# Altium schematic sheet Main.SchDoc
size A3; SheetNumber: 1; SheetTotal: 1
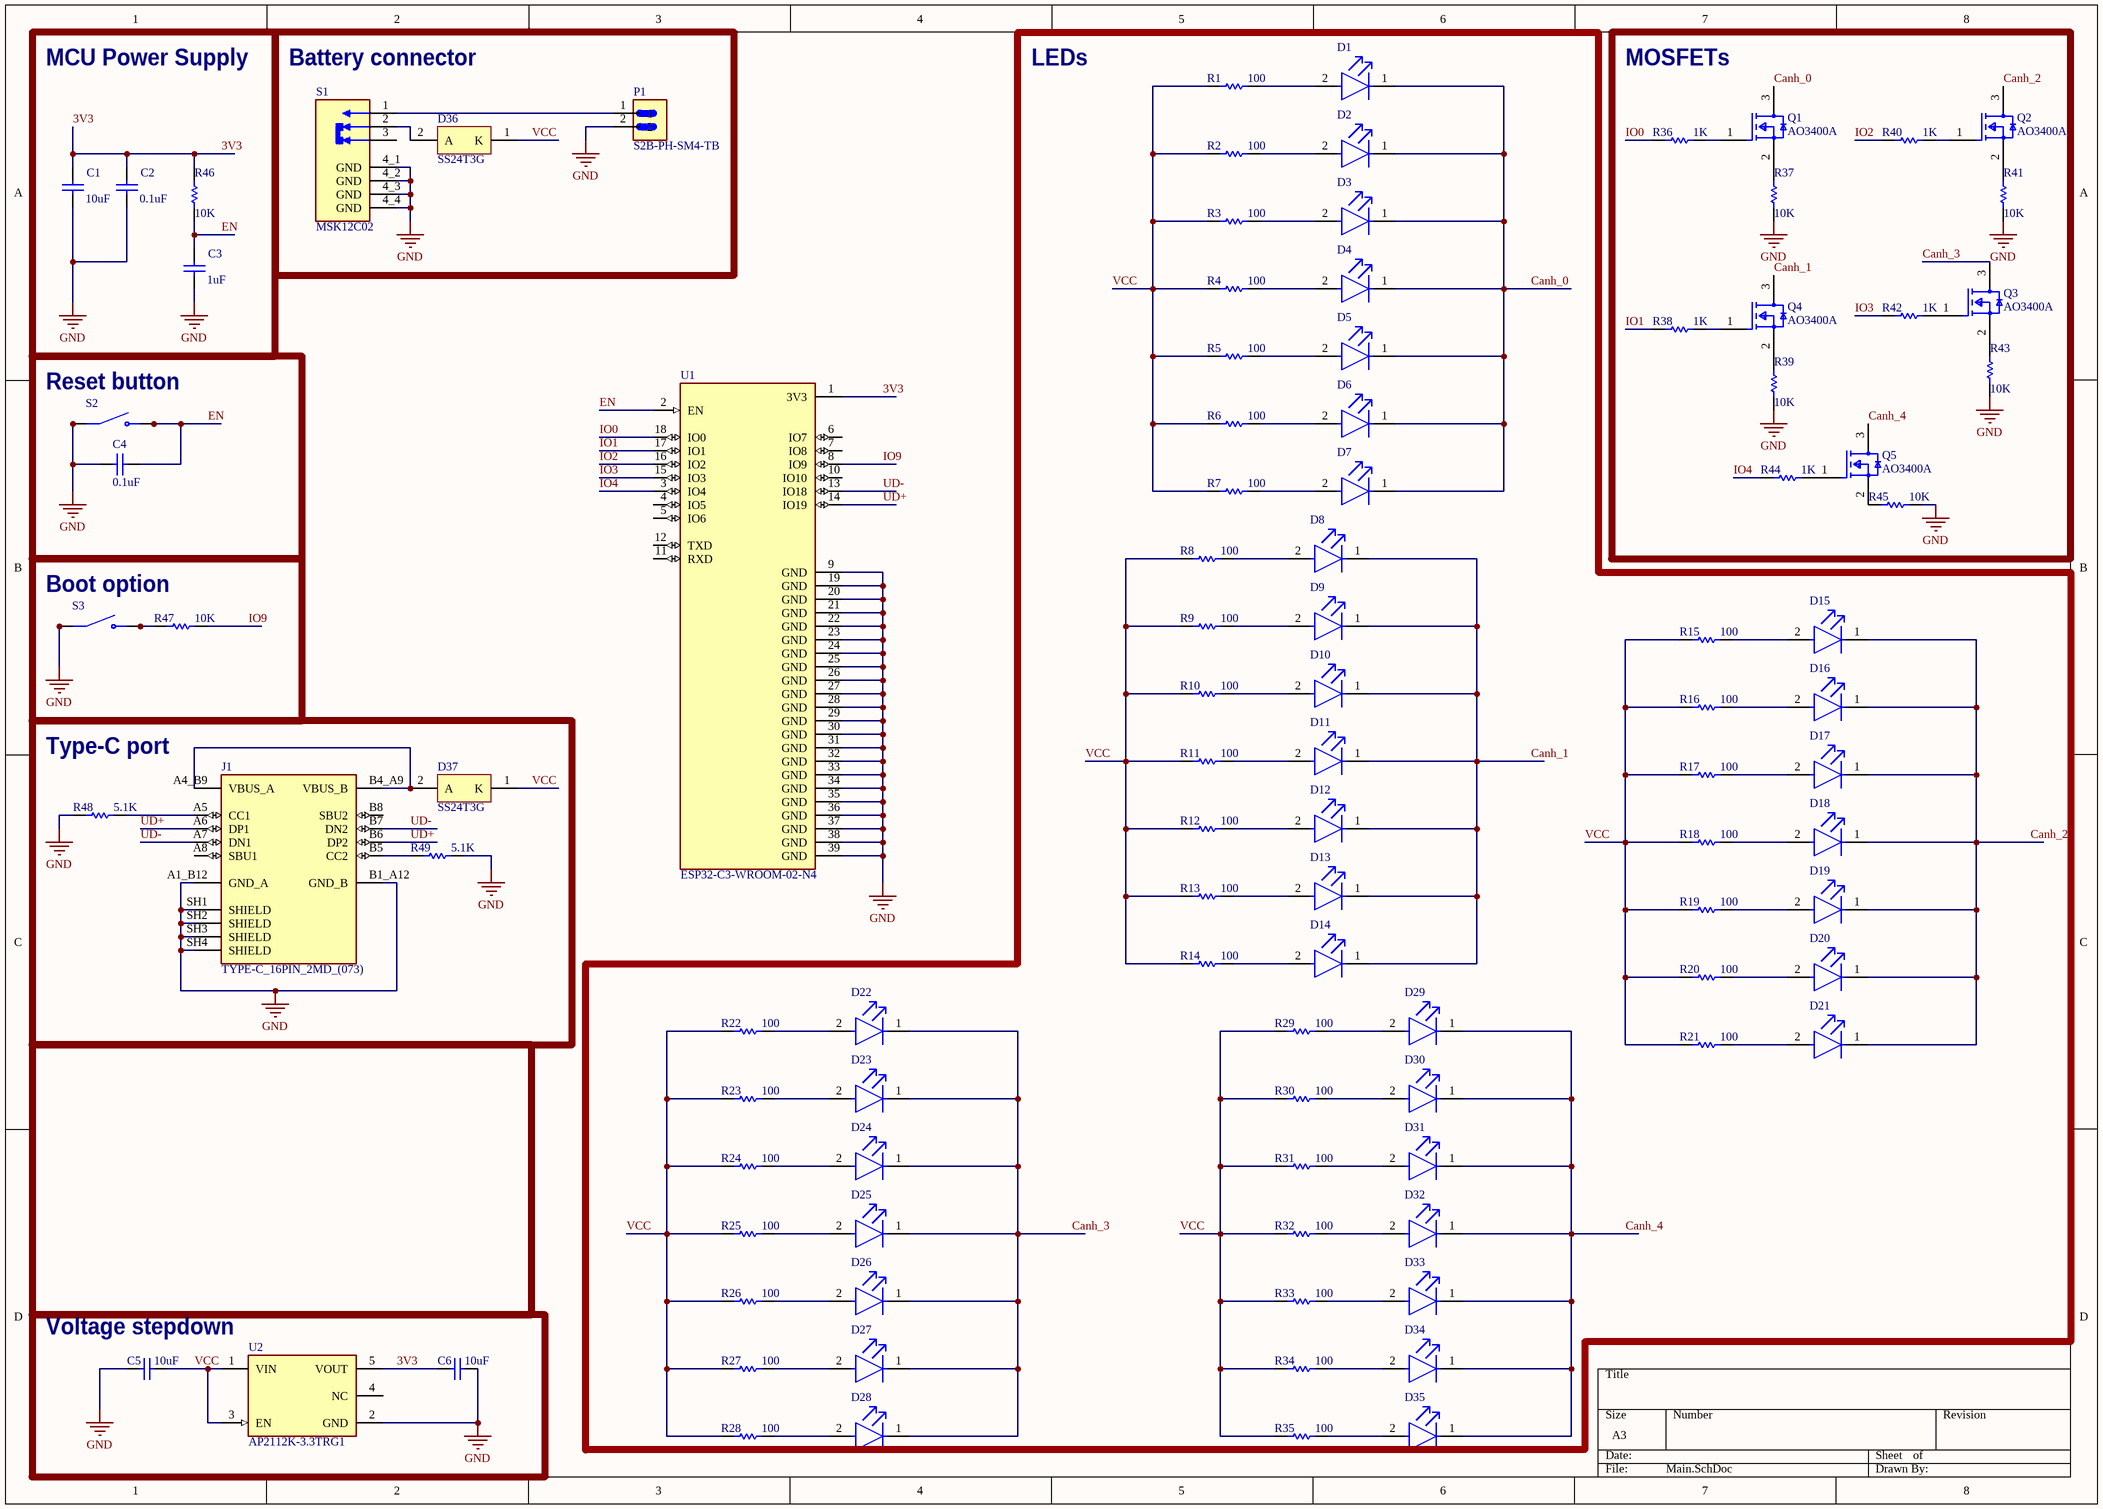
[diagram p0: Main.SchDoc]

## Parts
C1  value 10uF  [1608[0603]cap]  (hidden comment: Cap Semi)
C2  value 0.1uF  [1608[0603]cap]  (hidden comment: Cap Semi)
C3  value 1uF  [1608[0603]cap]  (hidden comment: Cap Semi)
C4  value 0.1uF  [1608[0603]cap]  (hidden comment: Cap Semi)
C5  value 10uF  [1608[0603]cap]  (hidden comment: Cap Semi)
C6  value 10uF  [1608[0603]cap]  (hidden comment: Cap Semi)
D1  SSL-LX5093YD  [FP-SSL-LX5093YD-MFG]  (value not drawn)
D2  SSL-LX5093YD  [FP-SSL-LX5093YD-MFG]  (value not drawn)
D3  SSL-LX5093YD  [FP-SSL-LX5093YD-MFG]  (value not drawn)
D4  SSL-LX5093YD  [FP-SSL-LX5093YD-MFG]  (value not drawn)
D5  SSL-LX5093YD  [FP-SSL-LX5093YD-MFG]  (value not drawn)
D6  SSL-LX5093YD  [FP-SSL-LX5093YD-MFG]  (value not drawn)
D7  SSL-LX5093YD  [FP-SSL-LX5093YD-MFG]  (value not drawn)
D8  SSL-LX5093YD  [FP-SSL-LX5093YD-MFG]  (value not drawn)
D9  SSL-LX5093YD  [FP-SSL-LX5093YD-MFG]  (value not drawn)
D10  SSL-LX5093YD  [FP-SSL-LX5093YD-MFG]  (value not drawn)
D11  SSL-LX5093YD  [FP-SSL-LX5093YD-MFG]  (value not drawn)
D12  SSL-LX5093YD  [FP-SSL-LX5093YD-MFG]  (value not drawn)
D13  SSL-LX5093YD  [FP-SSL-LX5093YD-MFG]  (value not drawn)
D14  SSL-LX5093YD  [FP-SSL-LX5093YD-MFG]  (value not drawn)
D15  SSL-LX5093YD  [FP-SSL-LX5093YD-MFG]  (value not drawn)
D16  SSL-LX5093YD  [FP-SSL-LX5093YD-MFG]  (value not drawn)
D17  SSL-LX5093YD  [FP-SSL-LX5093YD-MFG]  (value not drawn)
D18  SSL-LX5093YD  [FP-SSL-LX5093YD-MFG]  (value not drawn)
D19  SSL-LX5093YD  [FP-SSL-LX5093YD-MFG]  (value not drawn)
D20  SSL-LX5093YD  [FP-SSL-LX5093YD-MFG]  (value not drawn)
D21  SSL-LX5093YD  [FP-SSL-LX5093YD-MFG]  (value not drawn)
D22  SSL-LX5093YD  [FP-SSL-LX5093YD-MFG]  (value not drawn)
D23  SSL-LX5093YD  [FP-SSL-LX5093YD-MFG]  (value not drawn)
D24  SSL-LX5093YD  [FP-SSL-LX5093YD-MFG]  (value not drawn)
D25  SSL-LX5093YD  [FP-SSL-LX5093YD-MFG]  (value not drawn)
D26  SSL-LX5093YD  [FP-SSL-LX5093YD-MFG]  (value not drawn)
D27  SSL-LX5093YD  [FP-SSL-LX5093YD-MFG]  (value not drawn)
D28  SSL-LX5093YD  [FP-SSL-LX5093YD-MFG]  (value not drawn)
D29  SSL-LX5093YD  [FP-SSL-LX5093YD-MFG]  (value not drawn)
D30  SSL-LX5093YD  [FP-SSL-LX5093YD-MFG]  (value not drawn)
D31  SSL-LX5093YD  [FP-SSL-LX5093YD-MFG]  (value not drawn)
D32  SSL-LX5093YD  [FP-SSL-LX5093YD-MFG]  (value not drawn)
D33  SSL-LX5093YD  [FP-SSL-LX5093YD-MFG]  (value not drawn)
D34  SSL-LX5093YD  [FP-SSL-LX5093YD-MFG]  (value not drawn)
D35  SSL-LX5093YD  [FP-SSL-LX5093YD-MFG]  (value not drawn)
D36  SS24T3G  [ONSC-SMB-2-403A-03_V]
D37  SS24T3G  [ONSC-SMB-2-403A-03_V]
J1  TYPE-C_16PIN_2MD_(073)  [SHOUHAN_TYPE-C_16PIN_2MD_(073)]
P1  S2B-PH-SM4-TB  [JST_S2B-PH-SM4-TB]
Q1  AO3400A  [FP-SOT23-MFG]
Q2  AO3400A  [FP-SOT23-MFG]
Q3  AO3400A  [FP-SOT23-MFG]
Q4  AO3400A  [FP-SOT23-MFG]
Q5  AO3400A  [FP-SOT23-MFG]
R1  100  [MY_0603]
R2  100  [MY_0603]
R3  100  [MY_0603]
R4  100  [MY_0603]
R5  100  [MY_0603]
R6  100  [MY_0603]
R7  100  [MY_0603]
R8  100  [MY_0603]
R9  100  [MY_0603]
R10  100  [MY_0603]
R11  100  [MY_0603]
R12  100  [MY_0603]
R13  100  [MY_0603]
R14  100  [MY_0603]
R15  100  [MY_0603]
R16  100  [MY_0603]
R17  100  [MY_0603]
R18  100  [MY_0603]
R19  100  [MY_0603]
R20  100  [MY_0603]
R21  100  [MY_0603]
R22  100  [MY_0603]
R23  100  [MY_0603]
R24  100  [MY_0603]
R25  100  [MY_0603]
R26  100  [MY_0603]
R27  100  [MY_0603]
R28  100  [MY_0603]
R29  100  [MY_0603]
R30  100  [MY_0603]
R31  100  [MY_0603]
R32  100  [MY_0603]
R33  100  [MY_0603]
R34  100  [MY_0603]
R35  100  [MY_0603]
R36  1K  [MY_0603]
R37  10K  [MY_0603]
R38  1K  [MY_0603]
R39  10K  [MY_0603]
R40  1K  [MY_0603]
R41  10K  [MY_0603]
R42  1K  [MY_0603]
R43  10K  [MY_0603]
R44  1K  [MY_0603]
R45  10K  [MY_0603]
R46  10K  [MY_0603]
R47  10K  [MY_0603]
R48  5.1K  [MY_0603]
R49  5.1K  [MY_0603]
S1  MSK12C02  [SW_MSK12C02]
S2  1571527-2  [SW_1571527-2]  (value not drawn)
S3  1571527-2  [SW_1571527-2]  (value not drawn)
U1  ESP32-C3-WROOM-02-N4  [MODULE_ESP32-C3-WROOM-02-H4]
U2  AP2112K-3.3TRG1  [FP-SOT25-IPC_A]

## Blocks framed on the sheet
MCU Power Supply: C1-C3 R46
Battery connector: D36 P1 S1
LEDs: D1-D35 R1-R35
MOSFETs: Q1-Q5 R36-R45
Reset button: C4 S2
Boot option: R47 S3
Type-C port: D37 J1 R48 R49
Voltage stepdown: C5 C6 U2

## Nets
GND: C1.1 C2.1 C3.1 C4.2 C5.2 C6.1 J1.A1_B12(GND_A) J1.B1_A12(GND_B) J1.SH1(SHIELD) J1.SH2(SHIELD) J1.SH3(SHIELD) J1.SH4(SHIELD) P1.2 R37.1 R39.1 R41.1 R43.1 R45.1 R48.2 R49.1 S1.4_1(GND) S1.4_2(GND) S1.4_3(GND) S1.4_4(GND) S2.1(COM) S2.2(COM) S3.1(COM) S3.2(COM) U1.9(GND) U1.19(GND) U1.20(GND) U1.21(GND) U1.22(GND) U1.23(GND) U1.24(GND) U1.25(GND) U1.26(GND) U1.27(GND) U1.28(GND) U1.29(GND) U1.30(GND) U1.31(GND) U1.32(GND) U1.33(GND) U1.34(GND) U1.35(GND) U1.36(GND) U1.37(GND) U1.38(GND) U1.39(GND) U2.2(GND)
3V3: C1.2 C2.2 C6.2 R46.2 U1.1(3V3) U2.5(VOUT)
Canh_0: D1.1(C) D2.1(C) D3.1(C) D4.1(C) D5.1(C) D6.1(C) D7.1(C) Q1.3(D)
Canh_1: D8.1(C) D9.1(C) D10.1(C) D11.1(C) D12.1(C) D13.1(C) D14.1(C) Q4.3(D)
Canh_2: D15.1(C) D16.1(C) D17.1(C) D18.1(C) D19.1(C) D20.1(C) D21.1(C) Q2.3(D)
Canh_3: D22.1(C) D23.1(C) D24.1(C) D25.1(C) D26.1(C) D27.1(C) D28.1(C) Q3.3(D)
Canh_4: D29.1(C) D30.1(C) D31.1(C) D32.1(C) D33.1(C) D34.1(C) D35.1(C) Q5.3(D)
EN: C3.2 C4.1 R46.1 S2.3(NO) S2.4(NO) U1.2(EN)
IO0: R36.1 U1.18(IO0)
IO1: R38.1 U1.17(IO1)
IO2: R40.1 U1.16(IO2)
IO3: R42.1 U1.15(IO3)
IO4: R44.1 U1.3(IO4)
IO9: R47.1 U1.8(IO9)
UD+: J1.A6(DP1) J1.B6(DP2) U1.14(IO19)
UD-: J1.A7(DN1) J1.B7(DN2) U1.13(IO18)
VCC: C5.1 D36.1(K) D37.1(K) R1.1 R2.1 R3.1 R4.1 R5.1 R6.1 R7.1 R8.1 R9.1 R10.1 R11.1 R12.1 R13.1 R14.1 R15.1 R16.1 R17.1 R18.1 R19.1 R20.1 R21.1 R22.1 R23.1 R24.1 R25.1 R26.1 R27.1 R28.1 R29.1 R30.1 R31.1 R32.1 R33.1 R34.1 R35.1 U2.1(VIN) U2.3(EN)
NetD1_2: D1.2(A) R1.2
NetD2_2: D2.2(A) R2.2
NetD3_2: D3.2(A) R3.2
NetD4_2: D4.2(A) R4.2
NetD5_2: D5.2(A) R5.2
NetD6_2: D6.2(A) R6.2
NetD7_2: D7.2(A) R7.2
NetD8_2: D8.2(A) R8.2
NetD9_2: D9.2(A) R9.2
NetD10_2: D10.2(A) R10.2
NetD11_2: D11.2(A) R11.2
NetD12_2: D12.2(A) R12.2
NetD13_2: D13.2(A) R13.2
NetD14_2: D14.2(A) R14.2
NetD15_2: D15.2(A) R15.2
NetD16_2: D16.2(A) R16.2
NetD17_2: D17.2(A) R17.2
NetD18_2: D18.2(A) R18.2
NetD19_2: D19.2(A) R19.2
NetD20_2: D20.2(A) R20.2
NetD21_2: D21.2(A) R21.2
NetD22_2: D22.2(A) R22.2
NetD23_2: D23.2(A) R23.2
NetD24_2: D24.2(A) R24.2
NetD25_2: D25.2(A) R25.2
NetD26_2: D26.2(A) R26.2
NetD27_2: D27.2(A) R27.2
NetD28_2: D28.2(A) R28.2
NetD29_2: D29.2(A) R29.2
NetD30_2: D30.2(A) R30.2
NetD31_2: D31.2(A) R31.2
NetD32_2: D32.2(A) R32.2
NetD33_2: D33.2(A) R33.2
NetD34_2: D34.2(A) R34.2
NetD35_2: D35.2(A) R35.2
NetD36_2: D36.2(A) S1.2
NetD37_2: D37.2(A) J1.A4_B9(VBUS_A) J1.B4_A9(VBUS_B)
NetJ1_A5: J1.A5(CC1) R48.1
NetJ1_B5: J1.B5(CC2) R49.2
NetP1_1: P1.1 S1.1
NetQ1_1: Q1.1(G) R36.2
NetQ1_2: Q1.2(S) R37.2
NetQ2_1: Q2.1(G) R40.2
NetQ2_2: Q2.2(S) R41.2
NetQ3_1: Q3.1(G) R42.2
NetQ3_2: Q3.2(S) R43.2
NetQ4_1: Q4.1(G) R38.2
NetQ4_2: Q4.2(S) R39.2
NetQ5_1: Q5.1(G) R44.2
NetQ5_2: Q5.2(S) R45.2
NetR47_2: R47.2 S3.3(NO) S3.4(NO)

Not connected (* = marked no-connect by the designer): J1 A8(SBU1) B8(SBU2); S1 3; U1 4(IO5) 5(IO6) 6(IO7) 7(IO8) 10(IO10) 11(RXD) 12(TXD); U2 4(NC)

## Library data of the parts
C1-C6 = Cap Semi: Capacitor (Semiconductor SIM Model); Published: 8-Jun-2000; LatestRevisionDate: 29-May-2009; LatestRevisionNote: IPC-7351 Footprint Added.; PackageReference: C1206; Publisher: Altium Limited; PackageDescription: Chip Capacitor
D1-D35 = CMP-57192-000007-1: LED YELLOW DIFFUSED T-1 3/4 T/H; Test Current: 20mA; Number of LEDs: 1; Dominant Wavelength: 568nm; Wavelength: 585nm; Forward Voltage: 2.1V; Lens Style: Dome; Viewing Angle: 60°; Luminous Intensity: 30mcd; Min Operating Temperature: -40°C; Packaging: Bulk; Width: 1.5inch; Lead Free: Lead Free; Number of Pins: 2; Color: Yellow; Case/Package: Radial; Forward Current: 20mA; REACH SVHC: No SVHC; Lens Transparency: Diffused; Weight: 0.01lb; Height: 8.6mm; Package Quantity: 1000; Series: -; Length: 0.5inch; Illumination Color: Yellow; Mount: Through Hole; Diameter: 5mm; RoHS Compliant: Yes; Lens Color: Yellow; Max Operating Temperature: 85°C
D36 D37 = CMP-1055-00372-1: Schottky Power Rectifier, 2-Pin SMB, Pb-Free, Tape and Reel; Manufacturer: On Semiconductor; IFSM Max (A): 75; Configuration: Single; ComponentLink3Description: Package Specification; PackageReference: SMB-2-403A-03; ComponentLink2URL: http://www.onsemi.cn/pub_link/Collateral/SS24-D.PDF; PackageVersion: Rev. J, 07/2012; PackageDescription: 2-Pin Small Molded Package, J-Bend Lead, Body 4.33 x 3.625 mm; ComponentLink1Description: Manufacturer URL; ComponentLink1URL: http://www.onsemi.com/; PartNumber: SS24T3G; RoHS: TRUE; ComponentLink2Description: Datasheet; Packing: Tape and Reel; Mounting Technology: Surface Mount; ComponentLink3URL: http://www.onsemi.com/pub_link/Collateral/403A-03.PDF; DatasheetVersion: Rev. 4
J1 = TYPE-C_16PIN_2MD_(073): DC-5V 5A Type C USB; MF: Shouhan; MP: TYPE-C 16PIN 2MD (073); SnapEDA_Link: https://www.snapeda.com/parts/TYPE-C%2016PIN%202MD%20(073)/Shouhan/view-part/?ref=snap; Package: Package; Value: *; Check_prices: https://www.snapeda.com/parts/TYPE-C%2016PIN%202MD%20(073)/Shouhan/view-part/?ref=eda
P1 = S2B-PH-SM4-TB: Connector Header Surface Mount, Right Angle 2 position 0.079 (2.00mm); MF: JST Sales; SnapEDA_Link: https://www.snapeda.com/parts/S2B-PH-SM4-TB/JST/view-part/?ref=snap; Package: None; Value: *; MP: S2B-PH-SM4-TB; Check_prices: https://www.snapeda.com/parts/S2B-PH-SM4-TB/JST/view-part/?ref=eda
Q1-Q5 = CMP-83955-000006-1: MOSFET N-CH 30V 5.7A SOT23; Input Capacitance: 630pF; Number of Elements: 1; Rds On Max: 26.5mR; Max Power Dissipation: 1.4W; Gate to Source Voltage (Vgs): 12V; Min Operating Temperature: -55°C; Lead Free: Lead Free; Number of Pins: 3; Drain to Source Voltage (Vdss): 30V; Case/Package: SOT-23; Mount: Surface Mount; Continuous Drain Current (ID): 5.7A; Radiation Hardening: No; Packaging: Tape and Reel; Max Operating Temperature: 150°C; Power Dissipation: 1.4W
R1-R49 = Res: Standard resistor; ASiD Part Number: Res-AS
  R1-R35: Value: 100
  R36 R38 R40 R42 R44: Value: 1K
  R37 R39 R41 R43 R45-R47: Value: 10K
  R48 R49: Value: 5.1K
S2 S3 = 1571527-2: Switch Tactile OFF (ON) SPST Round Button Gull Wing 0.05A 24VDC 0.98N SMD T/R; MF: TE Connectivity; SnapEDA_Link: https://www.snapeda.com/parts/1571527-2/TE+Connectivity/view-part/?ref=snap; Package: None; Value: *; MP: 1571527-2; Check_prices: https://www.snapeda.com/parts/1571527-2/TE+Connectivity/view-part/?ref=eda
U1 = ESP32-C3-WROOM-02-N4: WiFi Modules (802.11) (Engineering Samples) SMD module, ESP32-C3, 4MB SPI flash, PCB antenna, -40 C +85 C; MF: Espressif Systems; Value: *; SnapEDA_Link: https://www.snapeda.com/parts/ESP32-C3-WROOM-02-N4/Espressif+Systems/view-part/?ref=snap; Purchase-URL: https://pricing.snapeda.com/search/part/ESP32-C3-WROOM-02-N4/?ref=eda; Availability: In Stock; Price: None; Package: Package; Check_prices: https://www.snapeda.com/parts/ESP32-C3-WROOM-02-N4/Espressif+Systems/view-part/?ref=eda; MP: ESP32-C3-WROOM-02-N4
U2 = CMP-12756-000035-1: IC REG LINEAR 3.3V 600MA SOT25; Number of Regulators: 1; Output Type: Fixed; Polarity: Positive; Min Input Voltage: 2.5V; Max Input Voltage: 6V; Accuracy: 1.5%; Quiescent Current: 55uA; Dropout Voltage: 250mV; Min Operating Temperature: -40°C; Length: 3.1mm; Output Current: 600mA; Max Operating Temperature: 85°C; Package Quantity: 1; Output Voltage: 3.3V; Width: 1.7mm; Number of Outputs: 1; Packaging: Tape and Reel; Height: 1.3mm; Lead Free: Lead Free; Max Output Current: 600mA; Case/Package: SOT-23-5; Mount: Surface Mount; Number of Pins: 5
S1 = MSK12C02: Package: None; Price: None; Value: *; MP: MSK12C02; Availability: Unavailable